# EAGLE schematic ICEDevice (EAGLE 9.1.3)
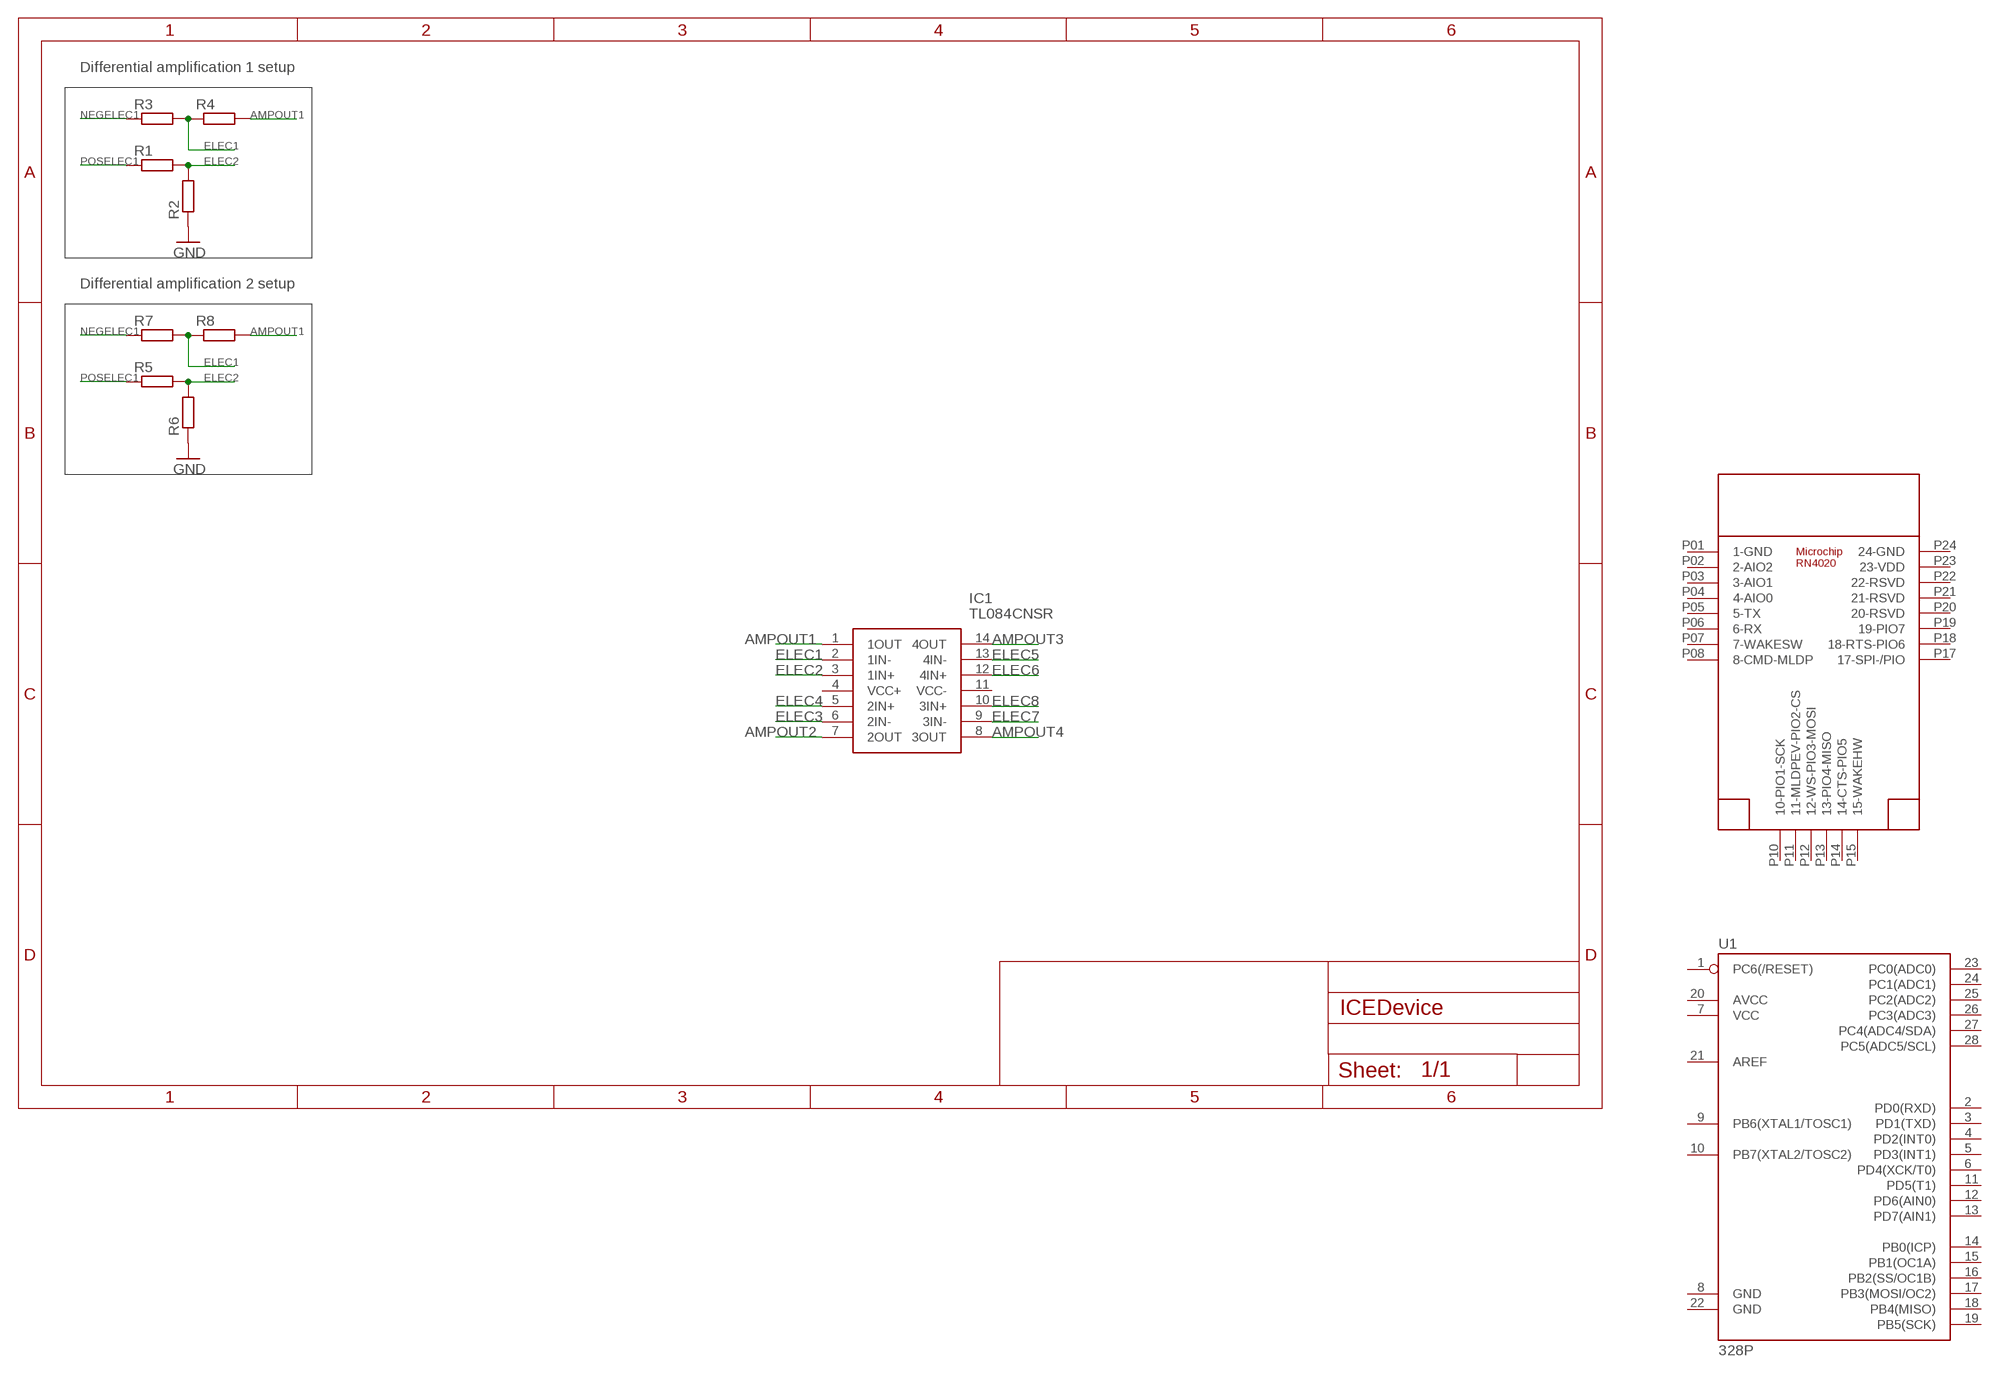
[diagram p0: schematic, sheet 1]

## Parts
IC1  TL084CNSR  [SOIC127P780X200-14N]
R1  R-EU_0309/10  [0309/10]
R2  R-EU_0309/10  [0309/10]
R3  R-EU_0309/10  [0309/10]
R4  R-EU_0309/10  [0309/10]
R5  R-EU_0309/10  [0309/10]
R6  R-EU_0309/10  [0309/10]
R7  R-EU_0309/10  [0309/10]
R8  R-EU_0309/10  [0309/10]
U1  328P  ATMEGA328P_PDIP  [DIP28]
U$1  RN4020  [RN4020SMD]

## Nets
AMPOUT1: IC1.1(1OUT) R4.2 R8.2
AMPOUT2: IC1.7(2OUT)
AMPOUT3: IC1.14(4OUT)
AMPOUT4: IC1.8(3OUT)
ELEC1: IC1.2(1IN-) R3.2 R4.1 R7.2 R8.1
ELEC2: IC1.3(1IN+) R1.2 R2.2 R5.2 R6.2
ELEC3: IC1.6(2IN-)
ELEC4: IC1.5(2IN+)
ELEC5: IC1.13(4IN-)
ELEC6: IC1.12(4IN+)
ELEC7: IC1.9(3IN-)
ELEC8: IC1.10(3IN+)
GND: R2.1 R6.1
NEGELEC1: R3.1 R7.1
POSELEC1: R1.1 R5.1
Unconnected: IC1.4(VCC+) IC1.11(VCC-) U1.1(PC6(/RESET)) U1.2(PD0(RXD)) U1.3(PD1(TXD)) U1.4(PD2(INT0)) U1.5(PD3(INT1)) U1.6(PD4(XCK/T0)) U1.7(VCC) U1.8(GND) U1.9(PB6(XTAL1/TOSC1)) U1.10(PB7(XTAL2/TOSC2)) U1.11(PD5(T1)) U1.12(PD6(AIN0)) U1.13(PD7(AIN1)) U1.14(PB0(ICP)) U1.15(PB1(OC1A)) U1.16(PB2(SS/OC1B)) U1.17(PB3(MOSI/OC2)) U1.18(PB4(MISO)) U1.19(PB5(SCK)) U1.20(AVCC) U1.21(AREF) U1.22(GND) U1.23(PC0(ADC0)) U1.24(PC1(ADC1)) U1.25(PC2(ADC2)) U1.26(PC3(ADC3)) U1.27(PC4(ADC4/SDA)) U1.28(PC5(ADC5/SCL)) U$1.P01(1-GND) U$1.P02(2-AIO2) U$1.P03(3-AIO1) U$1.P04(4-AIO0) U$1.P05(5-TX) U$1.P06(6-RX) U$1.P07(7-WAKESW) U$1.P08(8-CMD-MLDP) U$1.P10(10-PIO1-SCK) U$1.P11(11-MLDPEV-PIO2-CS) U$1.P12(12-WS-PIO3-MOSI) U$1.P13(13-PIO4-MISO) U$1.P14(14-CTS-PIO5) U$1.P15(15-WAKEHW) U$1.P17(17-SPI-/PIO) U$1.P18(18-RTS-PIO6) U$1.P19(19-PIO7) U$1.P20(20-RSVD) U$1.P21(21-RSVD) U$1.P22(22-RSVD) U$1.P23(23-VDD) U$1.P24(24-GND)

## Notes on the sheet
- Differential amplification 1 setup
- Differential amplification 2 setup

## Library data of the parts
IC1 = TL084CNSR:TL084CNSR: Quad High Slew Rate JFET-Input Operational Amplifier Source: Datasheet <http://www.ti.com/lit/gpn/tl084>; ARROW_PART_NUMBER: TL084CNSR; ARROW_PRICE-STOCK: https://www.arrow.com/en/products/tl084cnsr/texas-instruments; DESCRIPTION: Quad High Slew Rate JFET-Input Operational Amplifier; HEIGHT: 2mm; MANUFACTURER_NAME: Texas Instruments; MANUFACTURER_PART_NUMBER: TL084CNSR; RS_PART_NUMBER: 1626742; RS_PRICE-STOCK: http://uk.rs-online.com/web/p/products/1626742
R1-R8 = resistor:R-EU_: RESISTOR, European symbol
U1 = SparkFun-IC-Microcontroller:ATMEGA328P_PDIP: Atmel 328P Through hole ATMEGA328P uC used in the Arduino 32kb flash, 1k EEPROM, 2k SRAM Datasheet <http://www.sparkfun.com/datasheets/Components/SMD/ATMega328.pdf> SparkFun Products Storefront component: AVR 28 Pin 20MHz 32K 6A/D - ATMega328P <https://www.sparkfun.com/products/9061> (COM-09061) SparkFun Simon Says - Through-Hole Soldering Kit <https://www.sparkfun.com/products/10547> (KIT-10547) SparkFun Learn to Solder - Simon Says <https://www.sparkfun.com/products/13708> (KIT-13708) SparkFun BigTime Watch Kit <https://www.sparkfun.com/products/11734> (KIT-11734) SparkFun ClockIt <https://www.sparkfun.com/products/10930> (KIT-10930) SparkFun Serial Enabled LCD Kit <https://www.sparkfun.com/products/10097> (LCD-10097) SparkFun Simon Tilts - Through Hole Soldering Kit <https://www.sparkfun.com/products/12634> (KIT-12634) SparkFun Frequency Counter Kit <https://www.sparkfun.com/products/10140> (KIT-10140) FabFM Radio Kit <https://www.sparkfun.com/products/11043> (KIT-11043) SparkFun Binary Blaster Kit <https://www.sparkfun.com/products/12037> (KIT-12037) SparkFun Metro-Gnome <https://www.sparkfun.com/products/9236> (KIT-09236) ATmega328 with Arduino Optiboot (Uno) <https://www.sparkfun.com/products/10524> (DEV-10524); PROD_ID: IC-09136
U$1 = microchip_bluetooth_v101:RN4020